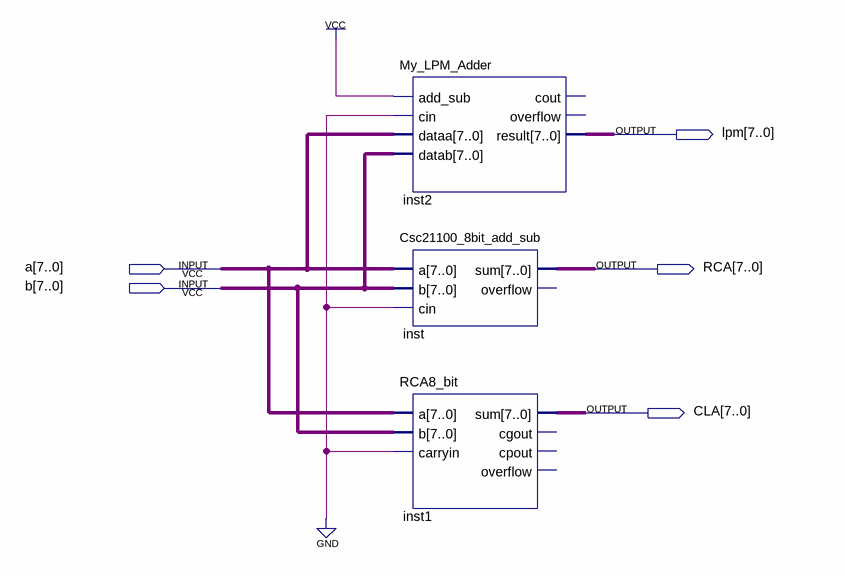
[diagram p0: schematic sheet]
// Quartus schematic Block2.bdf as structural Verilog: 3 symbols, 5 pins
module Block2 (
  input  [7:0] a,
  input  [7:0] b,
  output [7:0] lpm,
  output [7:0] RCA,
  output [7:0] CLA
);

  My_LPM_Adder inst2 (.add_sub(1'b1), .cin(1'b0), .dataa(a), .datab(b), .result(lpm));  // open: cout, overflow
  Csc21100_8bit_add_sub inst (.a(a), .b(b), .cin(1'b0), .sum(RCA));  // open: overflow
  RCA8_bit inst1 (.a(a), .b(b), .carryin(1'b0), .sum(CLA));  // open: cgout, cpout, overflow
endmodule
